# Altium schematic sheet audio_usb.SchDoc
size A4
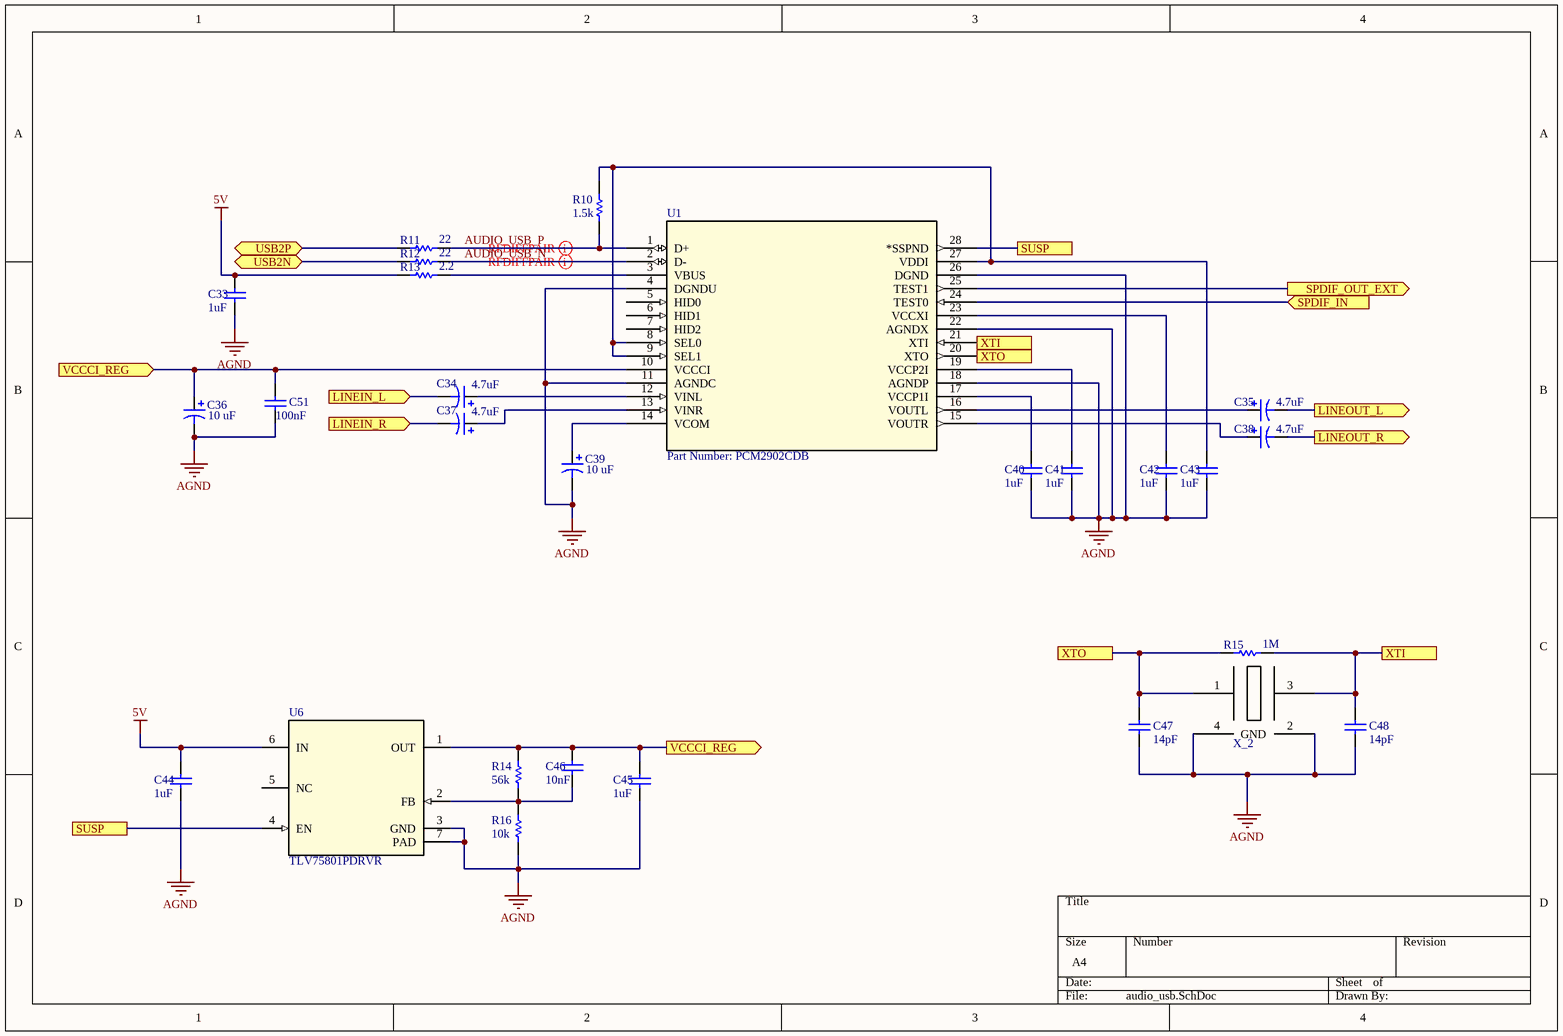
[diagram p0: audio_usb.SchDoc]

## Parts
C33  value 1uF  [C_0402]
C34  value 4.7uF  [CAPAE5453X54M]  (hidden comment: Cap Pol1)
C35  value 4.7uF  [CAPAE5453X54M]  (hidden comment: Cap Pol1)
C36  value 10 uF  [CAPAE5453X54M]  (hidden comment: Cap Pol1)
C37  value 4.7uF  [CAPAE5453X54M]  (hidden comment: Cap Pol1)
C38  value 4.7uF  [CAPAE5453X54M]  (hidden comment: Cap Pol1)
C39  value 10 uF  [CAPAE5453X54M]  (hidden comment: Cap Pol1)
C40  value 1uF  [C_0402]
C41  value 1uF  [C_0402]
C42  value 1uF  [C_0402]
C43  value 1uF  [C_0402]
C44  value 1uF  [C_0402]
C45  value 1uF  [C_0402]
C46  value 10nF  [C_0402]
C47  value 14pF  [C_0402]
C48  value 14pF  [C_0402]
C51  value 100nF  [C_0402]
R10  value 1.5k  [R_0402]  (hidden comment: Res1)
R11  value 22  [R_0402]  (hidden comment: Res1)
R12  value 22  [R_0402]  (hidden comment: Res1)
R13  value 2.2  [R_0402]  (hidden comment: Res1)
R14  value 56k  [R_0402]  (hidden comment: Res1)
R15  value 1M  [R_0402]  (hidden comment: Res1)
R16  value 10k  [R_0402]  (hidden comment: Res1)
U1  Part Number: PCM2902CDB  [SOP65P780X200-28N]
U6  TLV75801PDRVR  [DRV0006A]
X_2  X_48  [48Mhz 2x1.6mm SMD]  (value not drawn)

## Ports
LINEIN_L (in), LINEIN_R (in), LINEOUT_L (out), LINEOUT_R (out), SPDIF_IN (in), SPDIF_OUT_EXT (out), SUSP, USB2N (bidir), USB2P (bidir), VCCCI_REG (in), VCCCI_REG (out), XTI, XTO

## Nets
5V: C33.2 C44.2 R13.1 U6.6(IN)
AGND: C33.1 C36.2 C39.2 C40.1 C41.1 C42.1 C43.1 C44.1 C45.1 C47.1 C48.1 C51.1 R16.1 U1.4(DGNDU) U1.11(AGNDC) U1.18(AGNDP) U1.22(AGNDX) U1.26(DGND) U6.3(GND) U6.7(PAD) X_2.2(GND) X_2.4(GND)
AUDIO_USB_N: R12.2 U1.2(D-)
AUDIO_USB_P: R10.1 R11.2 U1.1(D+)
LINEIN_L: C34.2 ; port LINEIN_L
LINEIN_R: C37.2 ; port LINEIN_R
LINEOUT_L: C35.2 ; port LINEOUT_L
LINEOUT_R: C38.2 ; port LINEOUT_R
SPDIF_IN: U1.24(TEST0) ; port SPDIF_IN
SPDIF_OUT_EXT: U1.25(TEST1) ; port SPDIF_OUT_EXT
SUSP: U1.28(*SSPND) U6.4(EN) ; port SUSP
USB2N: R12.1 ; port USB2N
USB2P: R11.1 ; port USB2P
VCCCI_REG: C36.1 C45.2 C46.2 C51.2 R14.2 U1.10(VCCCI) U6.1(OUT) ; port VCCCI_REG
XTI: C48.2 R15.2 U1.21(XTI) X_2.3 ; port XTI
XTO: C47.2 R15.1 U1.20(XTO) X_2.1 ; port XTO
NetC34_1: C34.1 U1.12(VINL)
NetC35_1: C35.1 U1.16(VOUTL)
NetC37_1: C37.1 U1.13(VINR)
NetC38_1: C38.1 U1.15(VOUTR)
NetC39_1: C39.1 U1.14(VCOM)
NetC40_2: C40.2 U1.17(VCCP1I)
NetC41_2: C41.2 U1.19(VCCP2I)
NetC42_2: C42.2 U1.23(VCCXI)
NetC43_2: C43.2 R10.2 U1.8(SEL0) U1.9(SEL1) U1.27(VDDI)
NetC46_1: C46.1 R14.1 R16.2 U6.2(FB)
NetR13_2: R13.2 U1.3(VBUS)

Not connected (* = marked no-connect by the designer): U1 5(HID0) 6(HID1) 7(HID2); U6 5(NC)

## Layout directives
differential pair: AUDIO_USB_N, AUDIO_USB_P

## Library data of the parts
C33 C40-C48 C51 = Cap
C34-C39 = Cap Pol1: Polarized Capacitor (Radial)
R10-R16 = Res1: Resistor
U1 = PCM2902CDB: No Description Available; Manufacturer: Texas Instruments; Built_By: EMA_UL_Team; Vendor: Texas Instruments; Manufacturer_Part_Number: PCM2902CDB; Copyright: Copyright (C) 2018 Accelerated Designs. All rights reserved; RefDes: RefDes; Type: DEV; Value: Value
U6 = TLV75801PDRVR: Imported; Manufacturer: Texas Instruments; PartNumber: TLV75801PDRVR; RefDes: RefDes; TYPE: TYPE; Value: Value